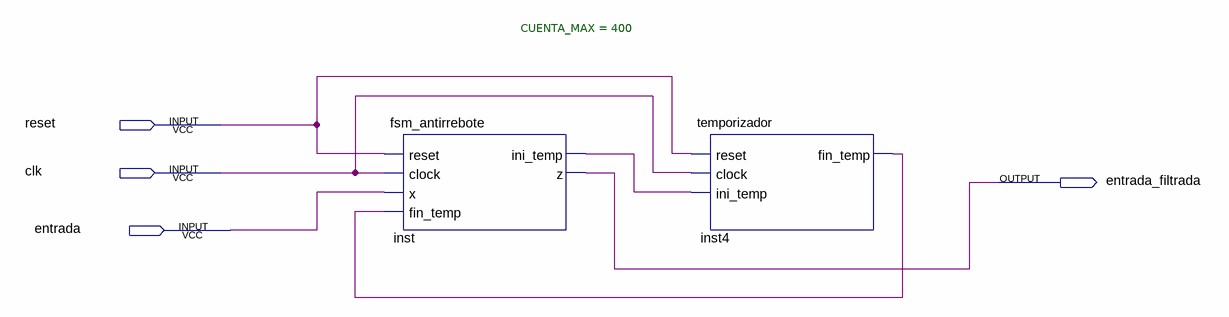
[diagram p0: schematic sheet]
// Quartus schematic antirrebote.bdf as structural Verilog: 2 symbols, 4 pins
module antirrebote (
  input  reset,
  input  clk,
  input  entrada,
  output entrada_filtrada
);

  wire inst4_fin_temp, inst_ini_temp;

  fsm_antirrebote inst (
    .reset(reset), .clock(clk), .x(entrada), .fin_temp(inst4_fin_temp), .ini_temp(inst_ini_temp),
    .z(entrada_filtrada));
  temporizador #(.CUENTA_MAX(400)) inst4 (
    .reset(reset), .clock(clk), .ini_temp(inst_ini_temp), .fin_temp(inst4_fin_temp));
endmodule
